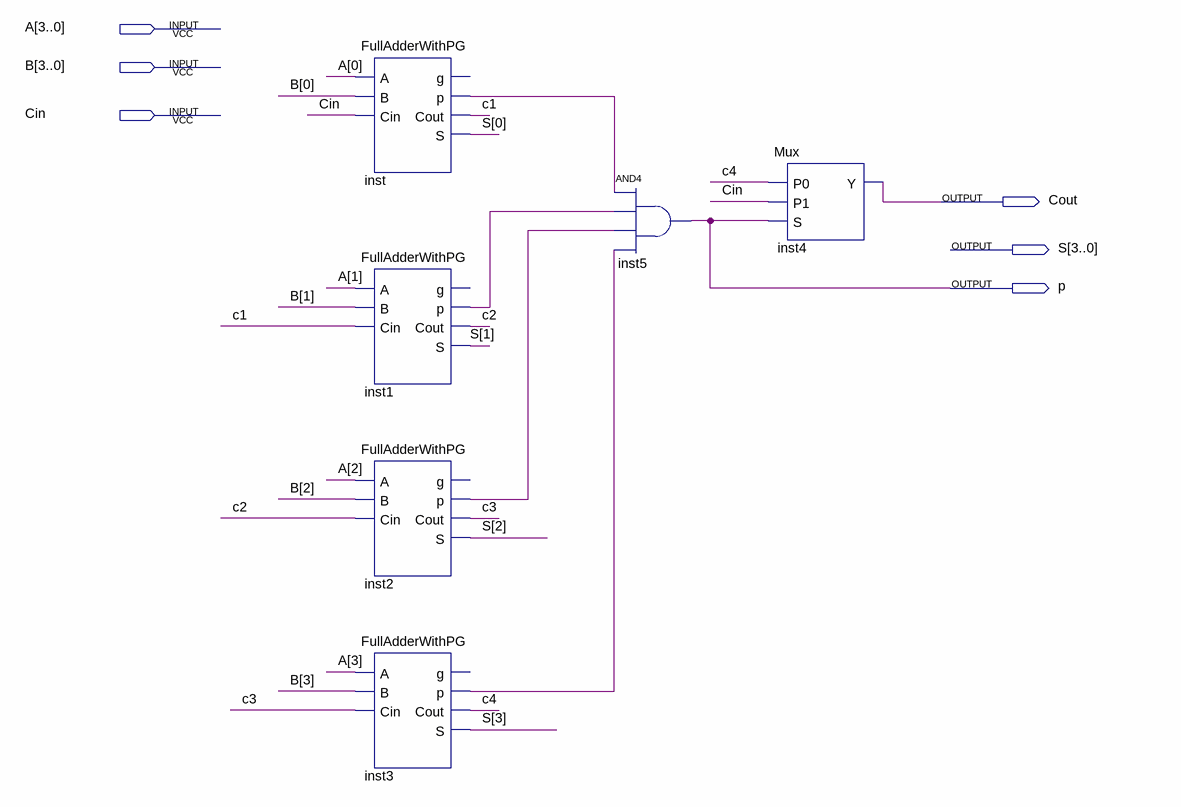
[diagram p0: schematic sheet]
// Quartus schematic CarrySkipAdder4BitWithP.bdf as structural Verilog: 6 symbols, 6 pins
module CarrySkipAdder4BitWithP (
  input  [3:0] A,
  input  [3:0] B,
  input  Cin,
  output Cout,
  output [3:0] S,
  output p
);

  wire c1, c2, c3, c4, inst1_p, inst2_p, inst3_p, inst_p;

  FullAdderWithPG inst (.A(A[0]), .B(B[0]), .Cin(Cin), .p(inst_p), .Cout(c1), .S(S[0]));  // open: g
  FullAdderWithPG inst1 (.A(A[1]), .B(B[1]), .Cin(c1), .p(inst1_p), .Cout(c2), .S(S[1]));  // open: g
  FullAdderWithPG inst2 (.A(A[2]), .B(B[2]), .Cin(c2), .p(inst2_p), .Cout(c3), .S(S[2]));  // open: g
  FullAdderWithPG inst3 (.A(A[3]), .B(B[3]), .Cin(c3), .p(inst3_p), .Cout(c4), .S(S[3]));  // open: g
  and inst5 (p, inst_p, inst1_p, inst2_p, inst3_p);
  Mux inst4 (.P0(c4), .P1(Cin), .S(p), .Y(Cout));
endmodule
